# EAGLE schematic dianlutu (EAGLE 9.3.2)
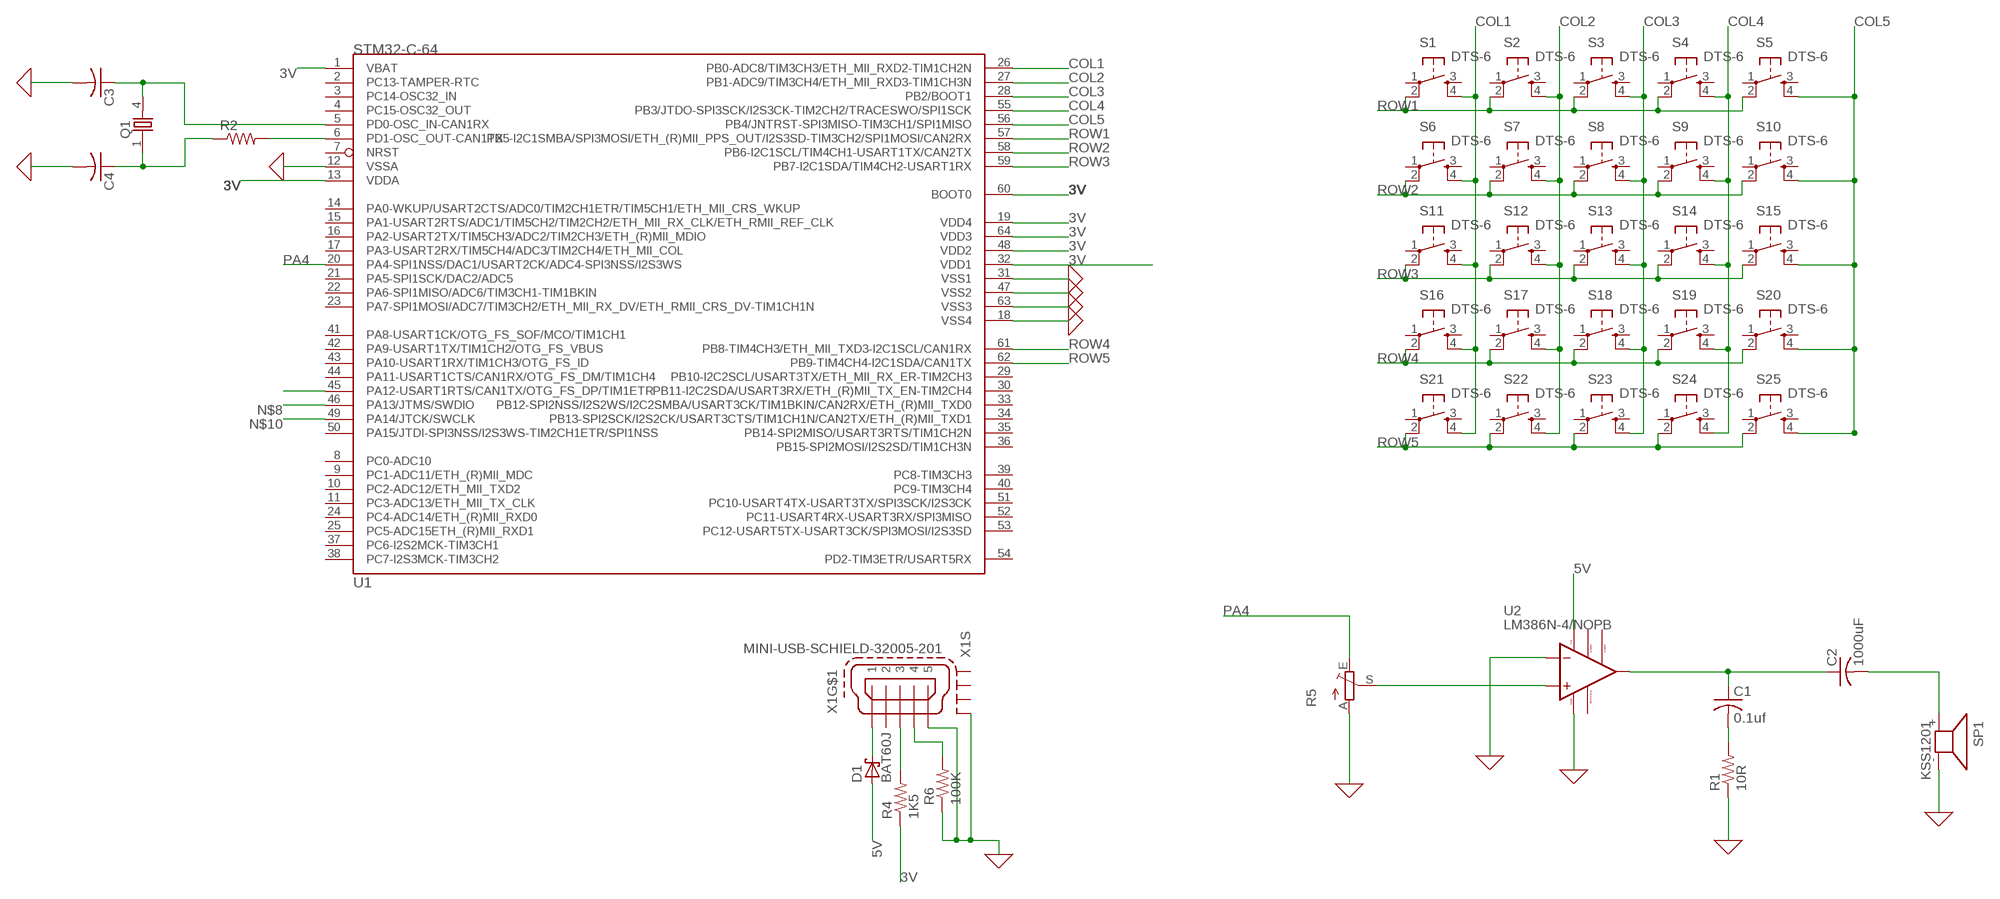
[diagram p0: schematic, sheet 1]

## Parts
C1  0.1uf  C-USC0805  [C0805]
C2  1000uF  C-USC0805  [C0805]
C3  C-USC0805  [C0805]
C4  C-USC0805  [C0805]
D1  BAT60J  [SOD323_ST]
Q1  86SMX  [86SMX]
R1  10R  R-US_R0805  [R0805]
R2  R-US_R0805  [R0805]
R4  1K5  R-US_R0805  [R0805]
R5  TRIM_EU-S63S  [S63S]
R6  100K  R-US_M0805  [M0805]
S1  DTS-6  [DTS-6]
S2  DTS-6  [DTS-6]
S3  DTS-6  [DTS-6]
S4  DTS-6  [DTS-6]
S5  DTS-6  [DTS-6]
S6  DTS-6  [DTS-6]
S7  DTS-6  [DTS-6]
S8  DTS-6  [DTS-6]
S9  DTS-6  [DTS-6]
S10  DTS-6  [DTS-6]
S11  DTS-6  [DTS-6]
S12  DTS-6  [DTS-6]
S13  DTS-6  [DTS-6]
S14  DTS-6  [DTS-6]
S15  DTS-6  [DTS-6]
S16  DTS-6  [DTS-6]
S17  DTS-6  [DTS-6]
S18  DTS-6  [DTS-6]
S19  DTS-6  [DTS-6]
S20  DTS-6  [DTS-6]
S21  DTS-6  [DTS-6]
S22  DTS-6  [DTS-6]
S23  DTS-6  [DTS-6]
S24  DTS-6  [DTS-6]
S25  DTS-6  [DTS-6]
SP1  KSS1201  [KSS1201]
U1  STM32-C-64  [LQFP64]
U2  LM386N-4/NOPB  [DIP794W45P254L1016H508Q8]
X1  MINI-USB-SCHIELD-32005-201  [32005-201]

## Nets
0: C3.2 C4.2 R1.1 R5.A R6.1 SP1.- U1.12(VSSA) U1.18(VSS4) U1.31(VSS1) U1.47(VSS2) U1.63(VSS3) U2.2(-INPUT) U2.4(GND) X1.5 X1.M1(S:S1) ; supply symbol labelled GND
3V: R4.1 U1.1(VBAT) U1.13(VDDA) U1.19(VDD4) U1.32(VDD1) U1.48(VDD2) U1.60(BOOT0) U1.64(VDD3)
5V: D1.A U2.6(VS)
COL1: S1.4 S6.4 S11.4 S16.4 S21.4 U1.26(PB0-ADC8/TIM3CH3/ETH_MII_RXD2-TIM1CH2N)
COL2: S2.4 S7.4 S12.4 S17.4 S22.4 U1.27(PB1-ADC9/TIM3CH4/ETH_MII_RXD3-TIM1CH3N)
COL3: S3.4 S8.4 S13.4 S18.4 S23.4 U1.28(PB2/BOOT1)
COL4: S4.4 S9.4 S14.4 S19.4 S24.4 U1.55(PB3/JTDO-SPI3SCK/I2S3CK-TIM2CH2/TRACESWO/SPI1SCK)
COL5: S5.4 S10.4 S15.4 S20.4 S25.4 U1.56(PB4/JNTRST-SPI3MISO-TIM3CH1/SPI1MISO)
N$1: D1.C X1.1
N$2: U1.45(PA12-USART1RTS/CAN1TX/OTG_FS_DP/TIM1ETR)
N$3: C2.2 SP1.+
N$4: R6.2 X1.4
N$5: C3.1 Q1.4 U1.5(PD0-OSC_IN-CAN1RX)
N$6: R2.2 U1.6(PD1-OSC_OUT-CAN1TX)
N$7: C4.1 Q1.1 R2.1
N$8: U1.46(PA13/JTMS/SWDIO)
N$9: C1.2 R1.2
N$10: U1.49(PA14/JTCK/SWCLK)
N$12: R5.S U2.3(+INPUT)
N$18: C1.1 C2.1 U2.5(VOUT)
PA4: R5.E U1.20(PA4-SPI1NSS/DAC1/USART2CK/ADC4-SPI3NSS/I2S3WS)
ROW1: S1.2 S2.2 S3.2 S4.2 S5.2 U1.57(PB5-I2C1SMBA/SPI3MOSI/ETH_(R)MII_PPS_OUT/I2S3SD-TIM3CH2/SPI1MOSI/CAN2RX)
ROW2: S6.2 S7.2 S8.2 S9.2 S10.2 U1.58(PB6-I2C1SCL/TIM4CH1-USART1TX/CAN2TX)
ROW3: S11.2 S12.2 S13.2 S14.2 S15.2 U1.59(PB7-I2C1SDA/TIM4CH2-USART1RX)
ROW4: S16.2 S17.2 S18.2 S19.2 S20.2 U1.61(PB8-TIM4CH3/ETH_MII_TXD3-I2C1SCL/CAN1RX)
ROW5: S21.2 S22.2 S23.2 S24.2 S25.2 U1.62(PB9-TIM4CH4-I2C1SDA/CAN1TX)
USB_DP: R4.2 X1.3
Unconnected: S1.1 S1.3 S2.1 S2.3 S3.1 S3.3 S4.1 S4.3 S5.1 S5.3 S6.1 S6.3 S7.1 S7.3 S8.1 S8.3 S9.1 S9.3 S10.1 S10.3 S11.1 S11.3 S12.1 S12.3 S13.1 S13.3 S14.1 S14.3 S15.1 S15.3 S16.1 S16.3 S17.1 S17.3 S18.1 S18.3 S19.1 S19.3 S20.1 S20.3 S21.1 S21.3 S22.1 S22.3 S23.1 S23.3 S24.1 S24.3 S25.1 S25.3 U1.2(PC13-TAMPER-RTC) U1.3(PC14-OSC32_IN) U1.4(PC15-OSC32_OUT) U1.7(NRST) U1.8(PC0-ADC10) U1.9(PC1-ADC11/ETH_(R)MII_MDC) U1.10(PC2-ADC12/ETH_MII_TXD2) U1.11(PC3-ADC13/ETH_MII_TX_CLK) U1.14(PA0-WKUP/USART2CTS/ADC0/TIM2CH1ETR/TIM5CH1/ETH_MII_CRS_WKUP) U1.15(PA1-USART2RTS/ADC1/TIM5CH2/TIM2CH2/ETH_MII_RX_CLK/ETH_RMII_REF_CLK) U1.16(PA2-USART2TX/TIM5CH3/ADC2/TIM2CH3/ETH_(R)MII_MDIO) U1.17(PA3-USART2RX/TIM5CH4/ADC3/TIM2CH4/ETH_MII_COL) U1.21(PA5-SPI1SCK/DAC2/ADC5) U1.22(PA6-SPI1MISO/ADC6/TIM3CH1-TIM1BKIN) U1.23(PA7-SPI1MOSI/ADC7/TIM3CH2/ETH_MII_RX_DV/ETH_RMII_CRS_DV-TIM1CH1N) U1.24(PC4-ADC14/ETH_(R)MII_RXD0) U1.25(PC5-ADC15ETH_(R)MII_RXD1) U1.29(PB10-I2C2SCL/USART3TX/ETH_MII_RX_ER-TIM2CH3) U1.30(PB11-I2C2SDA/USART3RX/ETH_(R)MII_TX_EN-TIM2CH4) U1.33(PB12-SPI2NSS/I2S2WS/I2C2SMBA/USART3CK/TIM1BKIN/CAN2RX/ETH_(R)MII_TXD0) U1.34(PB13-SPI2SCK/I2S2CK/USART3CTS/TIM1CH1N/CAN2TX/ETH_(R)MII_TXD1) U1.35(PB14-SPI2MISO/USART3RTS/TIM1CH2N) U1.36(PB15-SPI2MOSI/I2S2SD/TIM1CH3N) U1.37(PC6-I2S2MCK-TIM3CH1) U1.38(PC7-I2S3MCK-TIM3CH2) U1.39(PC8-TIM3CH3) U1.40(PC9-TIM3CH4) U1.41(PA8-USART1CK/OTG_FS_SOF/MCO/TIM1CH1) U1.42(PA9-USART1TX/TIM1CH2/OTG_FS_VBUS) U1.43(PA10-USART1RX/TIM1CH3/OTG_FS_ID) U1.44(PA11-USART1CTS/CAN1RX/OTG_FS_DM/TIM1CH4) U1.50(PA15/JTDI-SPI3NSS/I2S3WS-TIM2CH1ETR/SPI1NSS) U1.51(PC10-USART4TX-USART3TX/SPI3SCK/I2S3CK) U1.52(PC11-USART4RX-USART3RX/SPI3MISO) U1.53(PC12-USART5TX-USART3CK/SPI3MOSI/I2S3SD) U1.54(PD2-TIM3ETR/USART5RX) U2.1(GAIN1) U2.7(BYPASS) U2.8(GAIN2) X1.2 X1.M2(S:S2) X1.M3(S:S3) X1.M4(S:S4)

## Library data of the parts
C1-C4 = rcl:C-US: CAPACITOR, American symbol; SPICEPREFIX: C
D1 = diode:BAT60J: Schottky barrier diode Source: www.st.com, BAT60J.pdf
Q1 = crystal:86SMX: CRYSTAL; MF: C-MAC FREQUENCY PRODUCTS LTD; MPN: XTAL003321- 86SMX; OC_FARNELL: 6344914; OC_NEWARK: 01H9866
R1 R2 = rcl:R-US_: RESISTOR, American symbol; SPICEPREFIX: R
R4 R6 = resistor:R-US_: RESISTOR, American symbol
R5 = pot:TRIM_EU-: POTENTIOMETER
S1-S25 = switch-tact:DTS-6
SP1 = buzzer:KSS1201: SPEAKER Source: Schukat; OC_FARNELL: unknown; OC_NEWARK: unknown
U1 = pel_stm32:STM32-C-64
U2 = LM386N-4_NOPB:LM386N-4/NOPB: Linear IC - Audio amplifier Texas Instruments LM386N-4/NOPB 1-channel (mono) Class AB PDIP 8; AVAILABILITY: Unavailable; DESCRIPTION: Linear IC - Audio amplifier Texas Instruments LM386N-4/NOPB 1-channel _mono_ Class AB PDIP 8; MF: Texas Instruments; MP: LM386N-4/NOPB; PACKAGE: DIP-8 Texas Instruments; PRICE: None
X1 = con-cypressindustries:MINI-USB-SCHIELD-: MINI USB-B Conector Source: www.cypressindustries.com; OC_FARNELL: unknown; OC_NEWARK: unknown